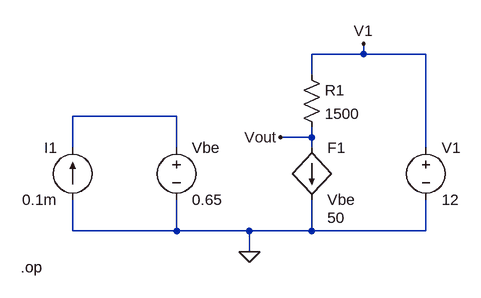
[diagram p0: schematic cccs.asc]
cccs.asc, the LTspice schematic file:
Version 4
SHEET 1 880 680
WIRE 320 -64 320 -80
WIRE 320 -64 240 -64
WIRE 416 -64 320 -64
WIRE 240 -32 240 -64
WIRE 32 32 -128 32
WIRE 240 64 240 48
WIRE 240 64 192 64
WIRE -128 80 -128 32
WIRE 32 80 32 32
WIRE 240 80 240 64
WIRE 416 80 416 -64
WIRE -128 208 -128 160
WIRE 32 208 32 160
WIRE 32 208 -128 208
WIRE 144 208 32 208
WIRE 240 208 240 160
WIRE 240 208 144 208
WIRE 416 208 416 160
WIRE 416 208 240 208
WIRE 144 240 144 208
FLAG 144 240 0
FLAG 192 64 Vout
FLAG 320 -80 V1
SYMBOL f 240 80 R0
WINDOW 123 24 108 Left 2
SYMATTR InstName F1
SYMATTR Value Vbe
SYMATTR Value2 50
SYMBOL res 224 -48 R0
SYMATTR InstName R1
SYMATTR Value 1500
SYMBOL voltage 416 64 R0
WINDOW 123 0 0 Left 0
WINDOW 39 0 0 Left 0
SYMATTR InstName V1
SYMATTR Value 12
SYMBOL current -128 160 R180
WINDOW 0 24 80 Left 2
WINDOW 3 24 0 Left 2
WINDOW 123 0 0 Left 0
WINDOW 39 0 0 Left 0
SYMATTR InstName I1
SYMATTR Value 0.1m
SYMBOL voltage 32 64 R0
WINDOW 123 0 0 Left 0
WINDOW 39 0 0 Left 0
SYMATTR InstName Vbe
SYMATTR Value 0.65
TEXT -208 264 Left 2 !.op

The netlist it stands for:
* cccs.asc
F1 Vout 0 Vbe 50
R1 V1 Vout 1500
V1 V1 0 12
I1 0 N001 0.1m
Vbe N001 0 0.65
.op
.backanno
.end